# Altium schematic sheet AC_board.SchDoc
size OrCAD E
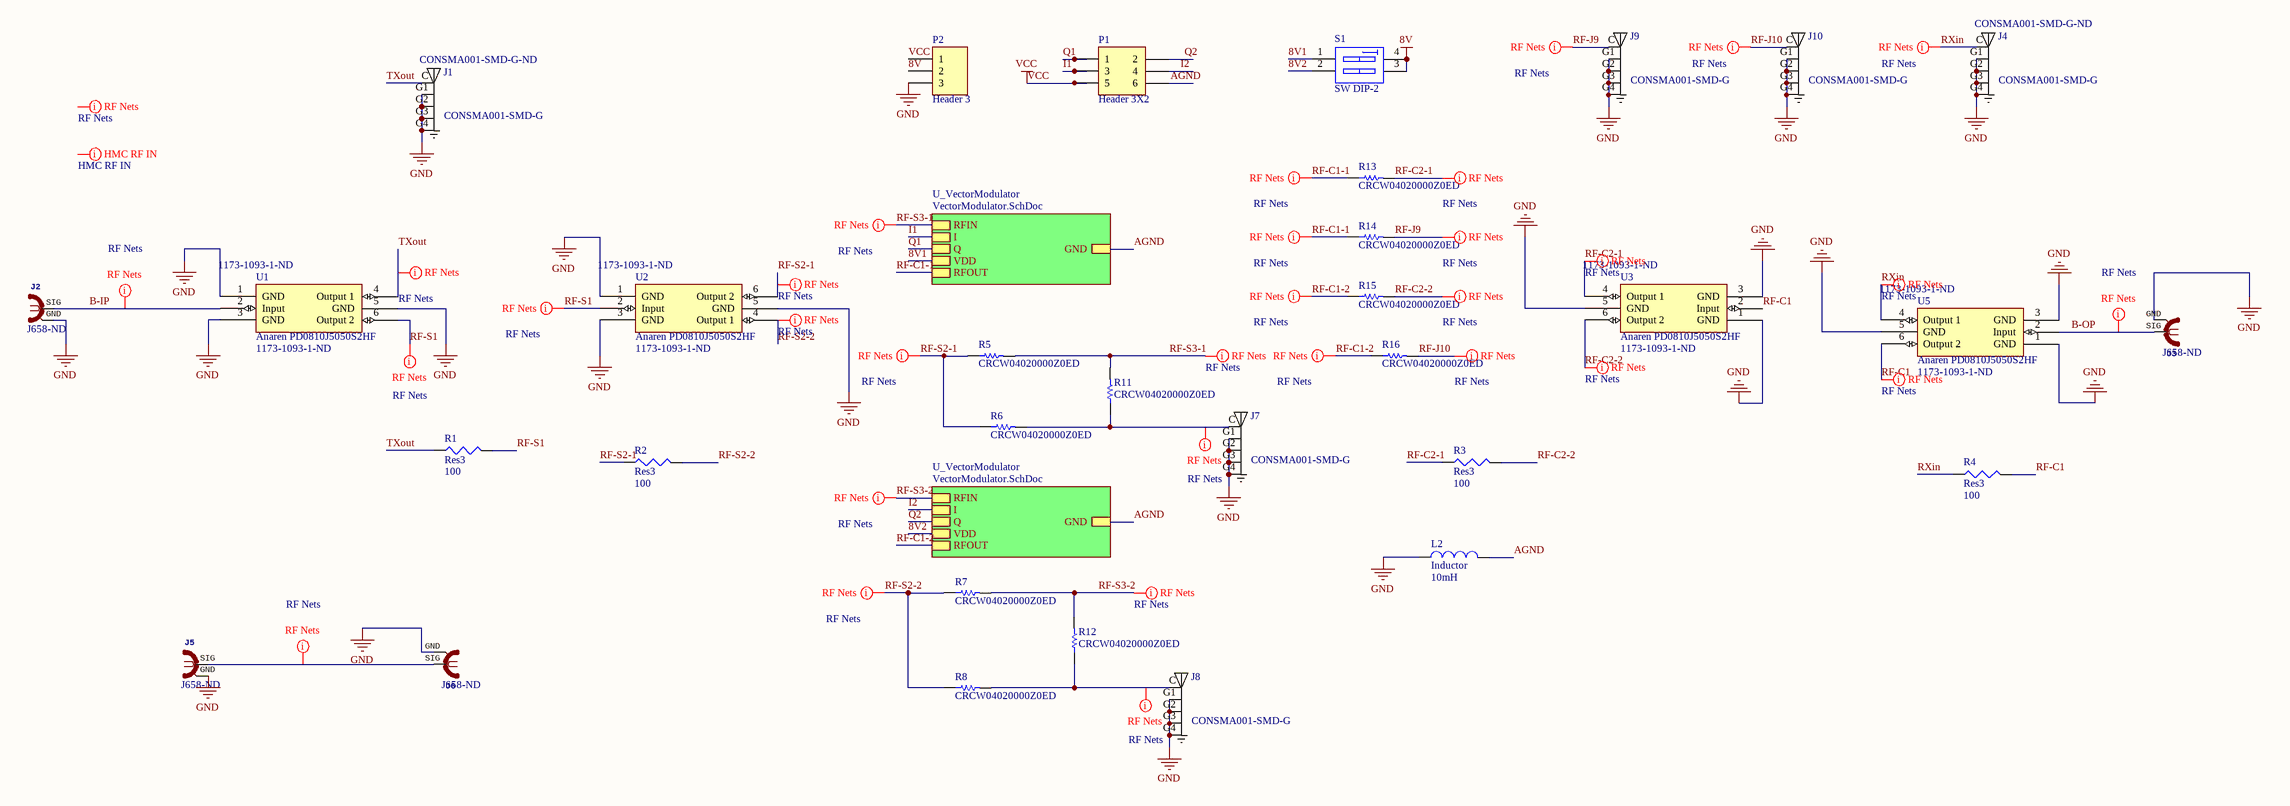
[diagram p0: AC_board.SchDoc]

## Parts
J1  CONSMA001-SMD-G  Supplier Part Number 1: CONSMA001-SMD-G-ND  [*LINX_CONSMA001-SMD-G_CONSMA001-SMD-G(Primary)]
J2  Supplier Part Number 1: J658-ND  [SMA-OSHPARK-4L-1.6MM- ALT3]  (hidden comment: SMA 50 Ohm edge)
J3  Supplier Part Number 1: J658-ND  [SMA-OSHPARK-4L-1.6MM- ALT3]  (hidden comment: SMA 50 Ohm edge)
J4  CONSMA001-SMD-G  Supplier Part Number 1: CONSMA001-SMD-G-ND  [*LINX_CONSMA001-SMD-G_CONSMA001-SMD-G(Primary)]
J5  Supplier Part Number 1: J658-ND  [SMA-OSHPARK-4L-1.6MM- ALT3]  (hidden comment: SMA 50 Ohm edge)
J6  Supplier Part Number 1: J658-ND  [SMA-OSHPARK-4L-1.6MM- ALT3]  (hidden comment: SMA 50 Ohm edge)
J7  CONSMA001-SMD-G  [*LINX_CONSMA001-SMD-G_CONSMA001-SMD-G(Primary)]
J8  CONSMA001-SMD-G  [*LINX_CONSMA001-SMD-G_CONSMA001-SMD-G(Primary)]
J9  CONSMA001-SMD-G  [*LINX_CONSMA001-SMD-G_CONSMA001-SMD-G(Primary)]
J10  CONSMA001-SMD-G  [*LINX_CONSMA001-SMD-G_CONSMA001-SMD-G(Primary)]
L2  Inductor  value 10mH  [0402-A]
P1  Header 3X2  [HDR2X3]
P2  Header 3  [HDR1X3]
R1  Res3  value 100  [J1-0603]
R2  Res3  value 100  [J1-0603]
R3  Res3  value 100  [J1-0603]
R4  Res3  value 100  [J1-0603]
R5  CRCW04020000Z0ED  [RESC1005X40X25ML05T05]
R6  CRCW04020000Z0ED  [RESC1005X40X25ML05T05]
R7  CRCW04020000Z0ED  [RESC1005X40X25ML05T05]
R8  CRCW04020000Z0ED  [RESC1005X40X25ML05T05]
R11  CRCW04020000Z0ED  [RESC1005X40X25ML05T05]
R12  CRCW04020000Z0ED  [RESC1005X40X25ML05T05]
R13  CRCW04020000Z0ED  [RESC1005X40X25ML05T05]
R14  CRCW04020000Z0ED  [RESC1005X40X25ML05T05]
R15  CRCW04020000Z0ED  [RESC1005X40X25ML05T05]
R16  CRCW04020000Z0ED  [RESC1005X40X25ML05T05]
S1  SW DIP-2  [DIP-4]
U1  Anaren PD0810J5050S2HF  U*: 1173-1093-1-ND  [*ANAREN_PD0409J7575S2HF]
U2  Anaren PD0810J5050S2HF  U*: 1173-1093-1-ND  [*ANAREN_PD0409J7575S2HF]
U3  Anaren PD0810J5050S2HF  U*: 1173-1093-1-ND  [*ANAREN_PD0409J7575S2HF]
U5  Anaren PD0810J5050S2HF  U*: 1173-1093-1-ND  [*ANAREN_PD0409J7575S2HF]

## Sub-sheets
U_VectorModulator = VectorModulator.SchDoc: RFIN, I, Q, VDD, RFOUT, GND
U_VectorModulator = VectorModulator.SchDoc: RFIN, I, Q, VDD, RFOUT, GND

## Nets
8V: P2.2 S1.3(B2) S1.4(B1)
GND: J1.G1(GND) J1.G2(GND) J1.G3(GND) J1.G4(GND) J2.GND J3.GND J4.G1(GND) J4.G2(GND) J4.G3(GND) J4.G4(GND) J5.GND J6.GND J7.G1(GND) J7.G2(GND) J7.G3(GND) J7.G4(GND) J8.G1(GND) J8.G2(GND) J8.G3(GND) J8.G4(GND) J9.G1(GND) J9.G2(GND) J9.G3(GND) J9.G4(GND) J10.G1(GND) J10.G2(GND) J10.G3(GND) J10.G4(GND) L2.1 P2.3 U1.1(GND) U1.3(GND) U1.5(GND) U2.1(GND) U2.3(GND) U2.5(GND) U3.1(GND) U3.3(GND) U3.5(GND) U5.1(GND) U5.3(GND) U5.5(GND)
VCC: P1.5 P2.1
8V1: S1.1(A1) ; sheet U_VectorModulator/VDD
8V2: S1.2(A2) ; sheet U_VectorModulator/VDD
AGND: L2.2 P1.6 ; sheet U_VectorModulator/GND, sheet U_VectorModulator/GND
B-IP: J2.SIG U1.2(Input)
B-OP: J3.SIG U5.2(Input)
I1: P1.3 ; sheet U_VectorModulator/I
I2: P1.4 ; sheet U_VectorModulator/I
Q1: P1.1 ; sheet U_VectorModulator/Q
Q2: P1.2 ; sheet U_VectorModulator/Q
RF-C1: R4.2 U3.2(Input) U5.6(Output_2)
RF-C1-1: R13.1 R14.1 ; sheet U_VectorModulator/RFOUT
RF-C1-2: R15.1 R16.1 ; sheet U_VectorModulator/RFOUT
RF-C2-1: R3.1 R13.2 U3.4(Output_1)
RF-C2-2: R3.2 R15.2 U3.6(Output_2)
RF-J9: J9.C(FEEDING) R14.2
RF-J10: J10.C(FEEDING) R16.2
RF-S1: R1.2 U1.6(Output_2) U2.2(Input)
RF-S2-1: R2.1 R5.1 R6.1 U2.6(Output_2)
RF-S2-2: R2.2 R7.1 R8.1 U2.4(Output_1)
RF-S3-1: R5.2 R11.2 ; sheet U_VectorModulator/RFIN
RF-S3-2: R7.2 R12.2 ; sheet U_VectorModulator/RFIN
RXin: J4.C(FEEDING) R4.1 U5.4(Output_1)
TXout: J1.C(FEEDING) R1.1 U1.4(Output_1)
NetJ5_SIG: J5.SIG J6.SIG
NetJ7_C: J7.C(FEEDING) R6.2 R11.1
NetJ8_C: J8.C(FEEDING) R8.2 R12.1

## Layout directives
net class RF Nets; rule Width MAXLIMIT=15.948mil MINLIMIT=15.948mil PREFEREDWIDTH=15.948mil; rule Clearance GAP=20mil: (no net found under the mark), B-IP, B-OP, NetJ5_SIG, NetJ7_C, NetJ8_C, RF-C1, RF-C1-1, RF-C1-2, RF-C2-1, RF-C2-2, RF-J9, RF-J10, RF-S1, RF-S2-1, RF-S2-2, RF-S3-1, RF-S3-2, RXin, TXout
net class HMC RF IN; rule Clearance GAP=5mil; rule Width MAXLIMIT=11.833mil MINLIMIT=11.833mil PREFEREDWIDTH=11.833mil: (no net found under the mark)

## Library data of the parts
J1 J4 J7-J10 = CONSMA001-SMD-G: 50 Ohm Gold Plated Female PCB Mount SMA Connector; MF: Linx Technologies; Package: None; Digi-Key_Part_Number: CONSMA001-SMD-G-ND; SnapEDA_Link: https://www.snapeda.com/parts/CONSMA001-SMD-G/Linx%20Technologies%20Inc./view-part/?ref=snap; Digi-Key_Purchase_URL: https://www.digikey.com/product-detail/en/linx-technologies-inc/CONSMA001-SMD-G/CONSMA001-SMD-G-ND/4496569?utm_source=snapeda&utm_medium=aggregator&utm_campaign=symbol; MP: CONSMA001-SMD-G; Value: *
  J1 J4: Supplier 1: Digi-Key
J2 J3 J5 J6 = SMA-OSHPARK-4L-1.6MM-ALT3: GateName_1: G1; SymbolName_1: COAX; DeviceName: -OSHPARK-4L-1.6MM; LibraryName: dword1511-connectors; DeviceSetName: SMA; Package: SMA-OSHPARK-4L-1.6MM; Supplier 1: Digi-Key
L2 = Inductor: Code_IEC: 1005; Published: 8-Jun-2000; LatestRevisionDate: 29-May-2009; LatestRevisionNote: IPC-7351 Footprint Added.; PackageReference: 0402-A; Publisher: Altium Limited; PackageDescription: Chip Inductor; Code_JEITA: 0402
P1 = Header 3X2: Header, 3-Pin, Dual row; LatestRevisionDate: 17-Jul-2002; LatestRevisionNote: Re-released for DXP Platform.; Publisher: Altium Limited
P2 = Header 3: Header, 3-Pin; LatestRevisionDate: 17-Jul-2002; LatestRevisionNote: Re-released for DXP Platform.; Publisher: Altium Limited
R1-R4 = Res3: Resistor; Published: 8-Jun-2000; LatestRevisionDate: 29-May-2009; LatestRevisionNote: IPC-7351 Footprint Added.; PackageReference: J1-0603; Publisher: Altium Limited; PackageDescription: Chip Resistor
R5-R8 R11-R16 = CMP-2002-08122-1: Manufacturer: Vishay Dale; Part Number: CRCW04020000Z0ED
S1 = SW DIP-2: DIP Switch, 2 Position, SPST; Published: 24-Mar-1999; LatestRevisionDate: 17-Jul-2002; LatestRevisionNote: Re-released for DXP Platform.; PackageReference: DIP-4; Publisher: Altium Limited
U1-U3 U5 = Anaren PD0810J5050S2HF: Supplier 1: Digi-Key; Supplier Part Number 1: 1173-1093-1-ND